# Altium schematic sheet Sch_Stick.SchDoc: Control de Domótica
size A4; Author: Francisco González González - Eugenia Ipar; CompanyName: Conexión del LPC1769; Organization: Altium Limited; Address1: L3, 12a Rodborough Rd; Address2: Frenchs Forest; Address3: NSW; Address4: Australia 2086; DocumentNumber: 2; SheetNumber: 2; SheetTotal: 12; Materia: Técnicas Digitales II; Year: 2015; Placa: Conexión a LPCXpresso 1769; Prof1: Prof: Alarcón, Juan; Prof2: Ayud: Crivelli, Marcelo; Prof3: Ayud: Montalti, Pablo
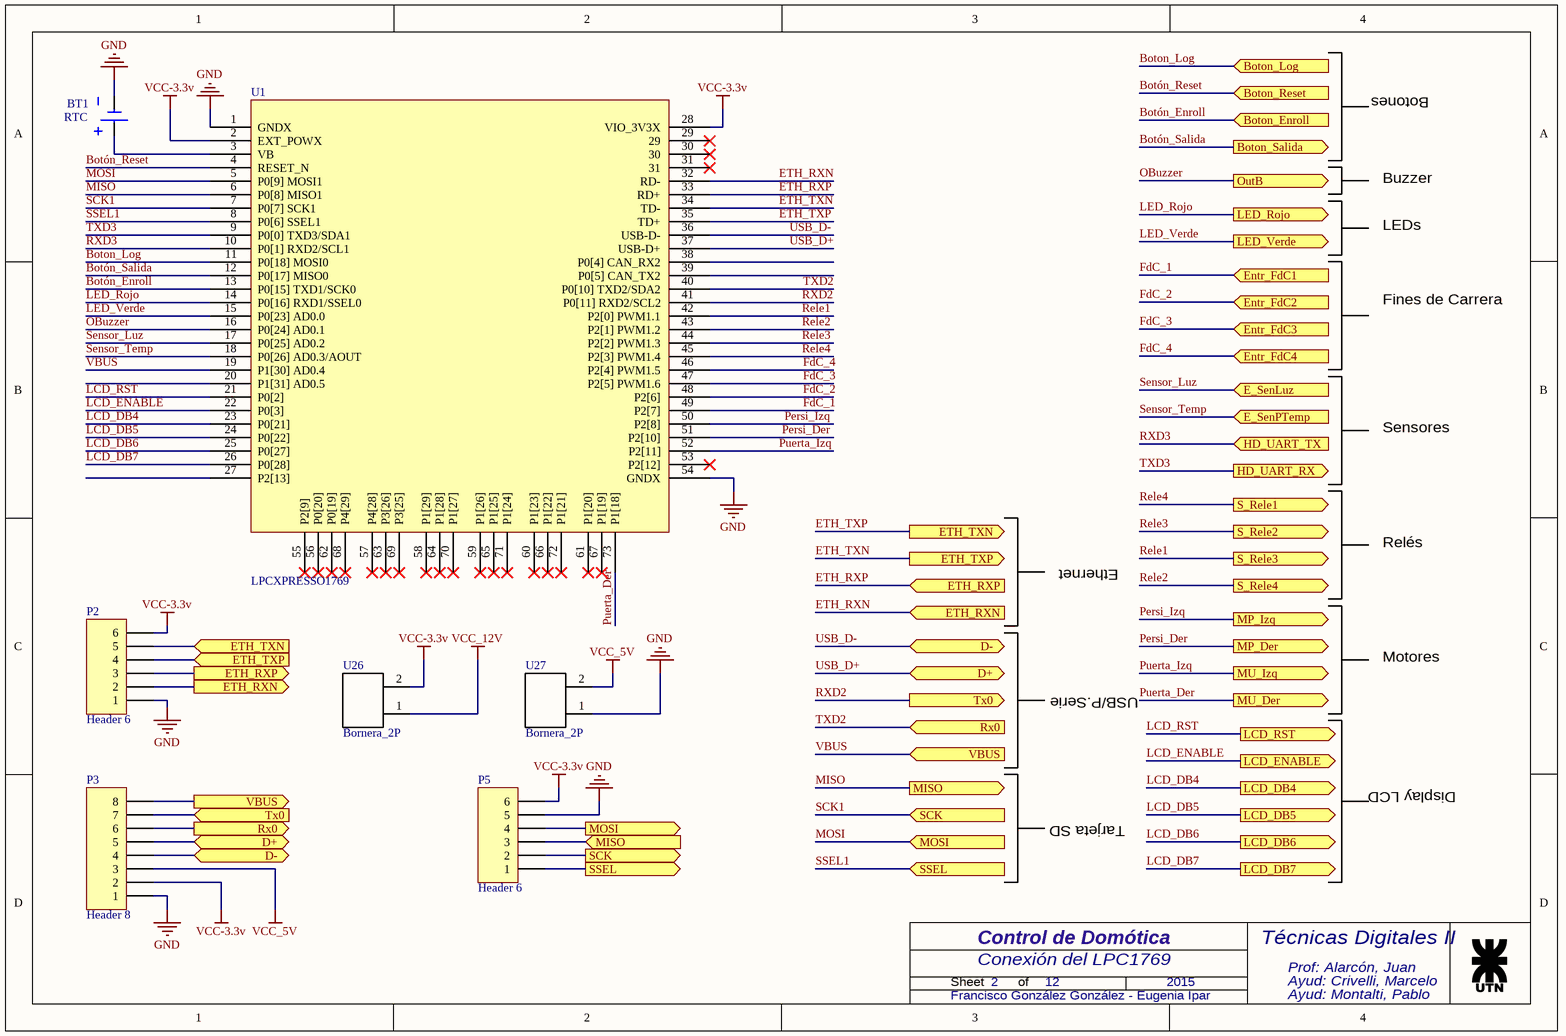
[diagram p0: Sch_Stick.SchDoc]

## Parts
BT1  Comment_1: RTC  [TECO-120591-1-2_V]  (hidden comment: 120591-1)
P2  Header 6  [HDR1X6]
P3  Header 8  [HDR1X8]
P5  Header 6  [HDR1X6]
U1  LPCXPRESSO1769  [Stick]
U26  Bornera_2P  [Bornera]
U27  Bornera_2P  [Bornera]

## Ports
Boton_Enroll (in), Boton_Log (in), Boton_Reset (in), Boton_Salida (out), D+ (bidir), D- (bidir), E_SenLuz (in), E_SenPTemp (in), Entr_FdC1 (in), Entr_FdC2 (in), Entr_FdC3 (in), Entr_FdC4 (in), ETH_RXN (in), ETH_RXN (out), ETH_RXP (in), ETH_RXP (out), ETH_TXN (in), ETH_TXN (out), ETH_TXP (in), ETH_TXP (out), HD_UART_RX (out), HD_UART_TX (in), LCD_DB4 (out), LCD_DB5 (out), LCD_DB6 (out), LCD_DB7 (out), LCD_ENABLE (out), LCD_RST (out), LED_Rojo (out), LED_Verde (out), MISO (in), MISO (out), MOSI (in), MOSI (out), MP_Der (out), MP_Izq (out), MU_Der (out), MU_Izq (out), OutB (out), Rx0 (in), Rx0 (out), S_Rele1 (out), S_Rele2 (out), S_Rele3 (out), S_Rele4 (out), SCK (in), SCK (out), SSEL (in), SSEL (out), Tx0 (in), Tx0 (out), VBUS (in), VBUS (out)

## Nets
GND: BT1.2(-) P2.1 P3.1 P5.5 U1.1(GNDX) U1.54(GNDX) U27.1
VCC-3.3v: P2.6 P3.2 P5.6 U1.2(EXT_POWX) U1.28(VIO_3V3X) U26.2
VCC_5V: P3.3 U27.2
VCC_12V: U26.1
Boton_Log: U1.11(P0[18]_MOSI0) ; port Boton_Log
Botón_Enroll: U1.13(P0[15]_TXD1/SCK0) ; port Boton_Enroll
Botón_Reset: U1.4(RESET_N) ; port Boton_Reset
Botón_Salida: U1.12(P0[17]_MISO0) ; port Boton_Salida
ETH_RXN: P2.2 U1.32(RD-) ; port ETH_RXN
ETH_RXP: P2.3 U1.33(RD+) ; port ETH_RXP
ETH_TXN: P2.4 U1.34(TD-) ; port ETH_TXP
ETH_TXP: P2.5 U1.35(TD+) ; port ETH_TXN
FdC_1: U1.49(P2[7]) ; port Entr_FdC1
FdC_2: U1.48(P2[6]) ; port Entr_FdC2
FdC_3: U1.47(P2[5]_PWM1.6) ; port Entr_FdC3
FdC_4: U1.46(P2[4]_PWM1.5) ; port Entr_FdC4
LCD_DB4: U1.23(P0[21]) ; port LCD_DB4
LCD_DB5: U1.24(P0[22]) ; port LCD_DB5
LCD_DB6: U1.25(P0[27]) ; port LCD_DB6
LCD_DB7: U1.26(P0[28]) ; port LCD_DB7
LCD_ENABLE: U1.22(P0[3]) ; port LCD_ENABLE
LCD_RST: U1.21(P0[2]) ; port LCD_RST
LED_Rojo: U1.14(P0[16]_RXD1/SSEL0) ; port LED_Rojo
LED_Verde: U1.15(P0[23]_AD0.0) ; port LED_Verde
MISO: P5.3 U1.6(P0[8]_MISO1) ; port MISO
MOSI: P5.4 U1.5(P0[9]_MOSI1) ; port MOSI
OBuzzer: U1.16(P0[24]_AD0.1) ; port OutB
Persi_Der: U1.51(P2[10]) ; port MP_Der
Persi_Izq: U1.50(P2[8]) ; port MP_Izq
Puerta_Der: U1.73(P1[18]) ; port MU_Der
Puerta_Izq: U1.52(P2[11]) ; port MU_Izq
Rele1: U1.42(P2[0]_PWM1.1) ; port S_Rele3
Rele2: U1.43(P2[1]_PWM1.2) ; port S_Rele4
Rele3: U1.44(P2[2]_PWM1.3) ; port S_Rele2
Rele4: U1.45(P2[3]_PWM1.4) ; port S_Rele1
RXD2: P3.7 U1.41(P0[11]_RXD2/SCL2) ; port Tx0
RXD3: U1.10(P0[1]_RXD2/SCL1) ; port HD_UART_TX
SCK1: P5.2 U1.7(P0[7]_SCK1) ; port SCK
Sensor_Luz: U1.17(P0[25]_AD0.2) ; port E_SenLuz
Sensor_Temp: U1.18(P0[26]_AD0.3/AOUT) ; port E_SenPTemp
SSEL1: P5.1 U1.8(P0[6]_SSEL1) ; port SSEL
TXD2: P3.6 U1.40(P0[10]_TXD2/SDA2) ; port Rx0
TXD3: U1.9(P0[0]_TXD3/SDA1) ; port HD_UART_RX
USB_D+: P3.5 U1.37(USB-D+) ; port D+
USB_D-: P3.4 U1.36(USB-D-) ; port D-
VBUS: P3.8 U1.19(P1[30]_AD0.4) ; port VBUS
NetBT1_1: BT1.1(+) U1.3(VB)

Not connected (* = marked no-connect by the designer): U1 20(P1[31]_AD0.5) 27(P2[13]) 29* 30* 31* 38(P0[4]_CAN_RX2) 39(P0[5]_CAN_TX2) 53(P2[12])* 55(P2[9])* 56(P0[20])* 57(P4[28])* 58(P1[29])* 59(P1[26])* 60(P1[23])* 61(P1[20])* 62(P0[19])* 63(P3[26])* 64(P1[28])* 65(P1[25])* 66(P1[22])* 67(P1[19])* 68(P4[29])* 69(P3[25])* 70(P1[27])* 71(P1[24])* 72(P1[21])*

## Notes on the sheet
- Botones
- Buzzer
- LEDs
- Fines de Carrera
- Sensores
- Ethernet
- Relés
- USB/P.Serie
- Motores
- Display LCD
- Tarjeta SD
- Sheet
- of

## Library data of the parts
BT1 = CMP-0438-00001-1: Lithium Battery Holder for CR2032 3V Cell; Manufacturer: TE Connectivity; Body Shape: Horizontal Cylindrical; Packing Type: Tray; ComponentLink2Description: Datasheet; ComponentLink2URL: http://www.te.com/commerce/DocumentDelivery/DDEController?Action=showdoc&DocId=Customer+Drawing%7F120591%7FH%7Fpdf%7FEnglish%7FENG_CD_120591_H.pdf%7F120591-1; DatasheetVersion: Rev. H, 01/2013; PackageReference: 120591-1; ComponentLink1Description: Manufacturer URL; Mounting Technology: Through Hole; PackageDescription: Lithium Battery Holder; ComponentLink1URL: http://www.te.com/; PartNumber: 120591-1
P2 P5 = Header 6: Header, 6-Pin; LatestRevisionDate: 17-Jul-2002; LatestRevisionNote: Re-released for DXP Platform.; Publisher: Altium Limited
P3 = Header 8: Header, 8-Pin; LatestRevisionDate: 17-Jul-2002; LatestRevisionNote: Re-released for DXP Platform.; Publisher: Altium Limited
U1 = LPC1769_Stick